# Altium schematic sheet PSU_1084SET_1V8.SchDoc: PSU AP1084KL 1V8
size A4; Organization: Altium Limited.; Address1: Level 3, 12a Rodborough Rd; Address2: Frenchs Forest 2086; Address3: NSW; Address4: AUSTRALIA; DocumentNumber: 46; SheetNumber: 47; SheetTotal: 77
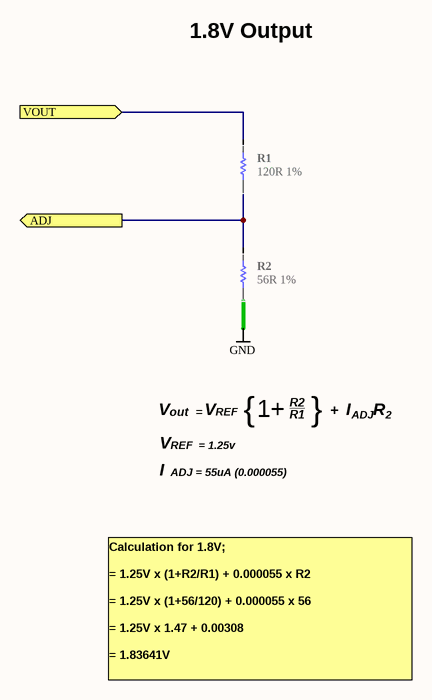
[diagram p0: PSU_1084SET_1V8.SchDoc]

## Parts
R1  120R 1%  [RESC1005-STAR]
R2  56R 1%  [RESC1005-STAR]

## Ports
ADJ (out), VOUT (in)

## Nets
GND: R2.2
ADJ: R1.1 R2.1 ; port ADJ
VOUT: R1.2 ; port VOUT

## Notes on the sheet
- 1.8V Output
- V
- out  =
- REF  = 1.25v
- REF
- {
- 1+
- R2
- R1
- }
- +
- I
- ADJ
- R
- 2
- ADJ = 55uA (0.000055)
- Calculation for 1.8V;
  = 1.25V x (1+R2/R1) + 0.000055 x R2
  = 1.25V x (1+56/120) + 0.000055 x 56
  = 1.25V x 1.47 + 0.00308
  = 1.83641V
- Sheet Title
- Project Title
- Size:
- Date:
- A4
- Assy:
- Time:
- Revision:
- Sheet
- of
- File:

## Library data of the parts
R1 = D-100-0126: Resistor, 120R 1% 0402 (1005); Power Rating: 63 mW; Category: Resistor; Mounting Technology: Surface Mount; Resistance: 120 R; Status: Production; Tolerance: 1 %
R2 = D-100-0174: Resistor, 56R 1% 0402; Power Rating: 1/16 W; Resistance: 56R mR; Mounting Technology: Surface Mount; Status: Unreleased; Tolerance: 1 %; Category: Resistor